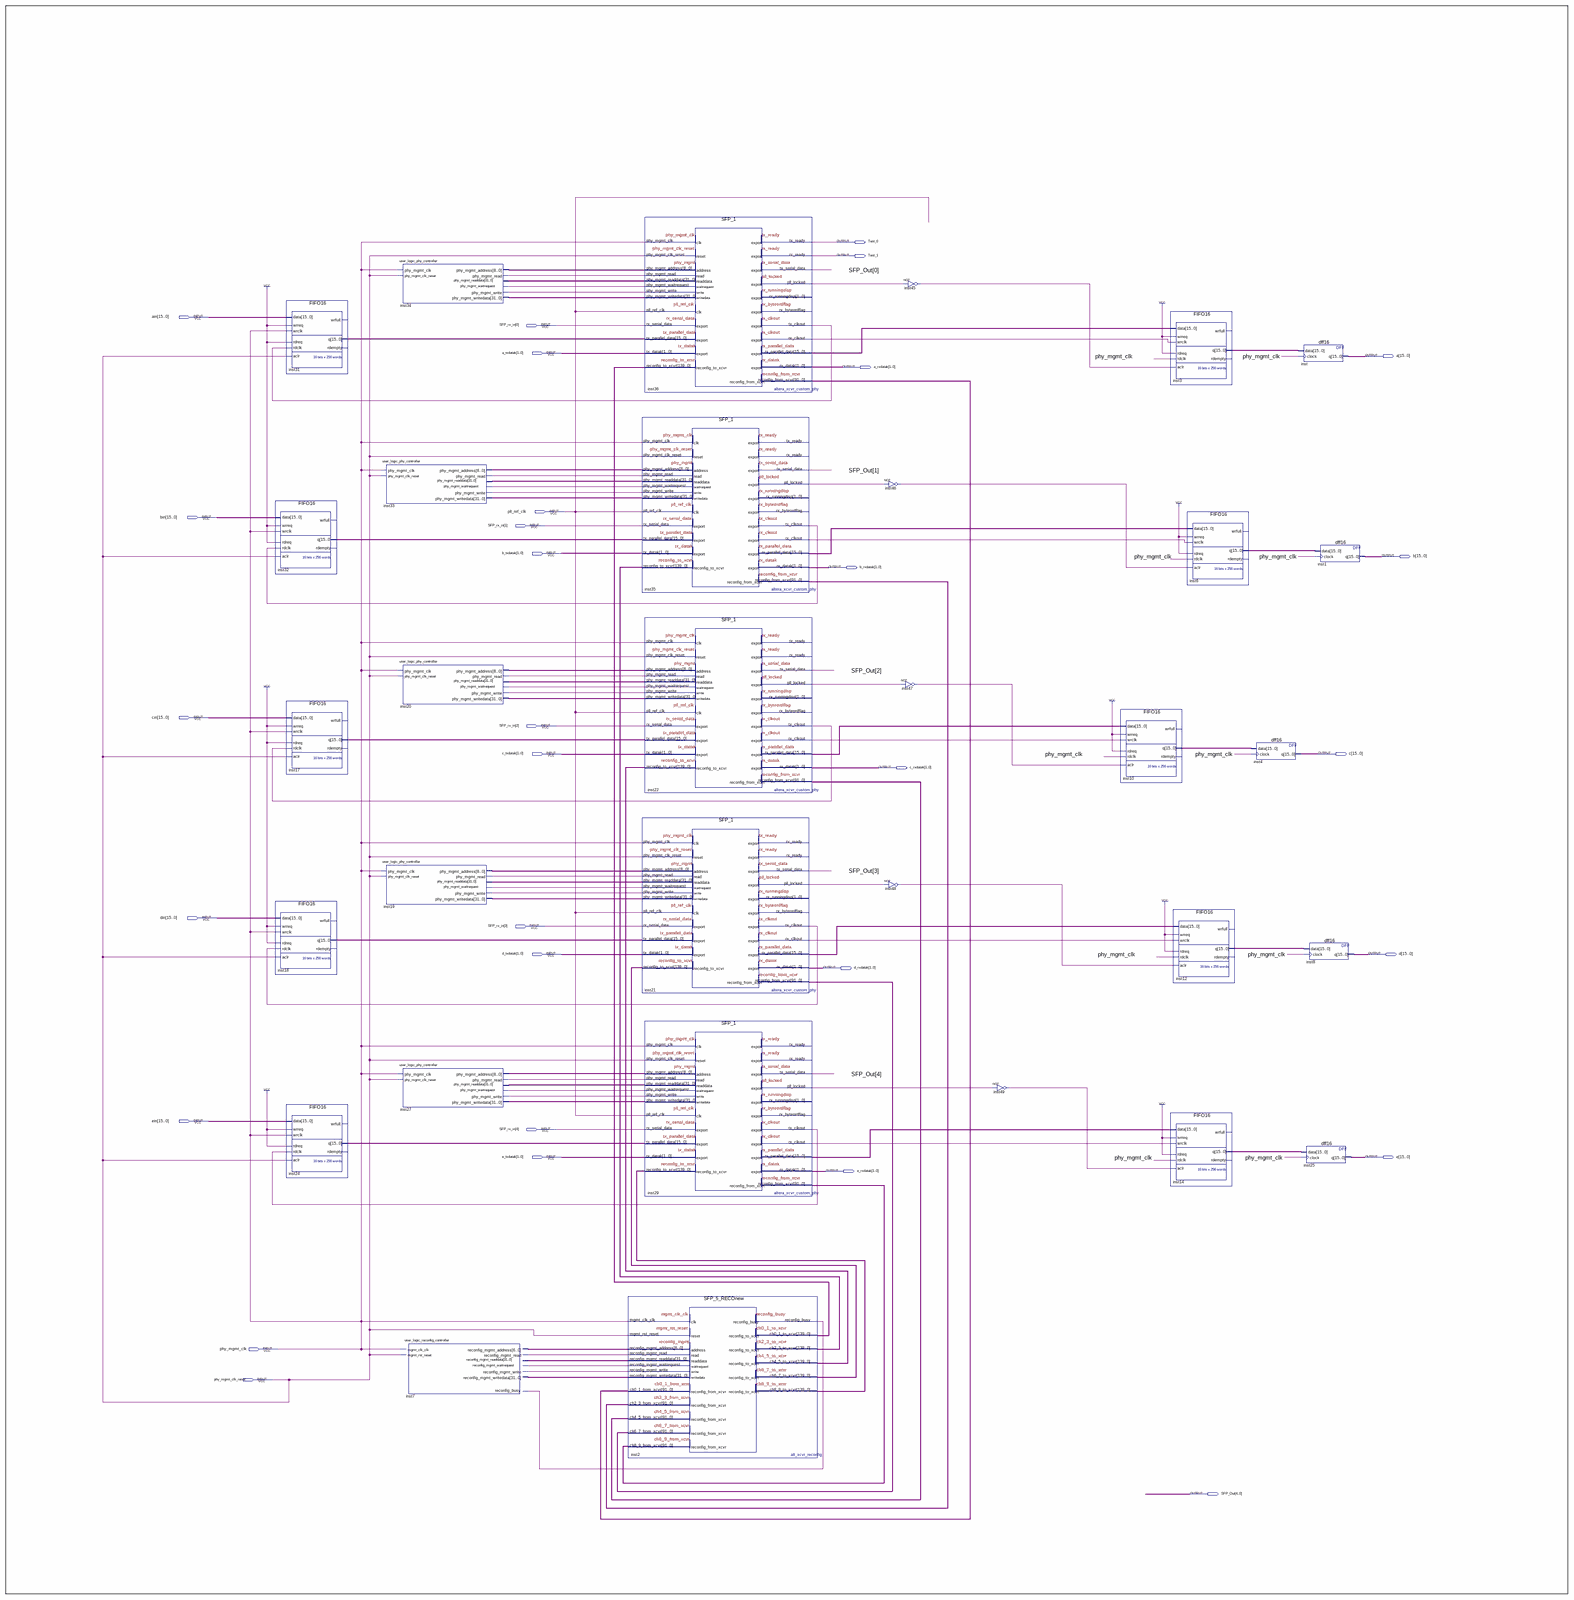
[diagram p0: schematic sheet, whole]
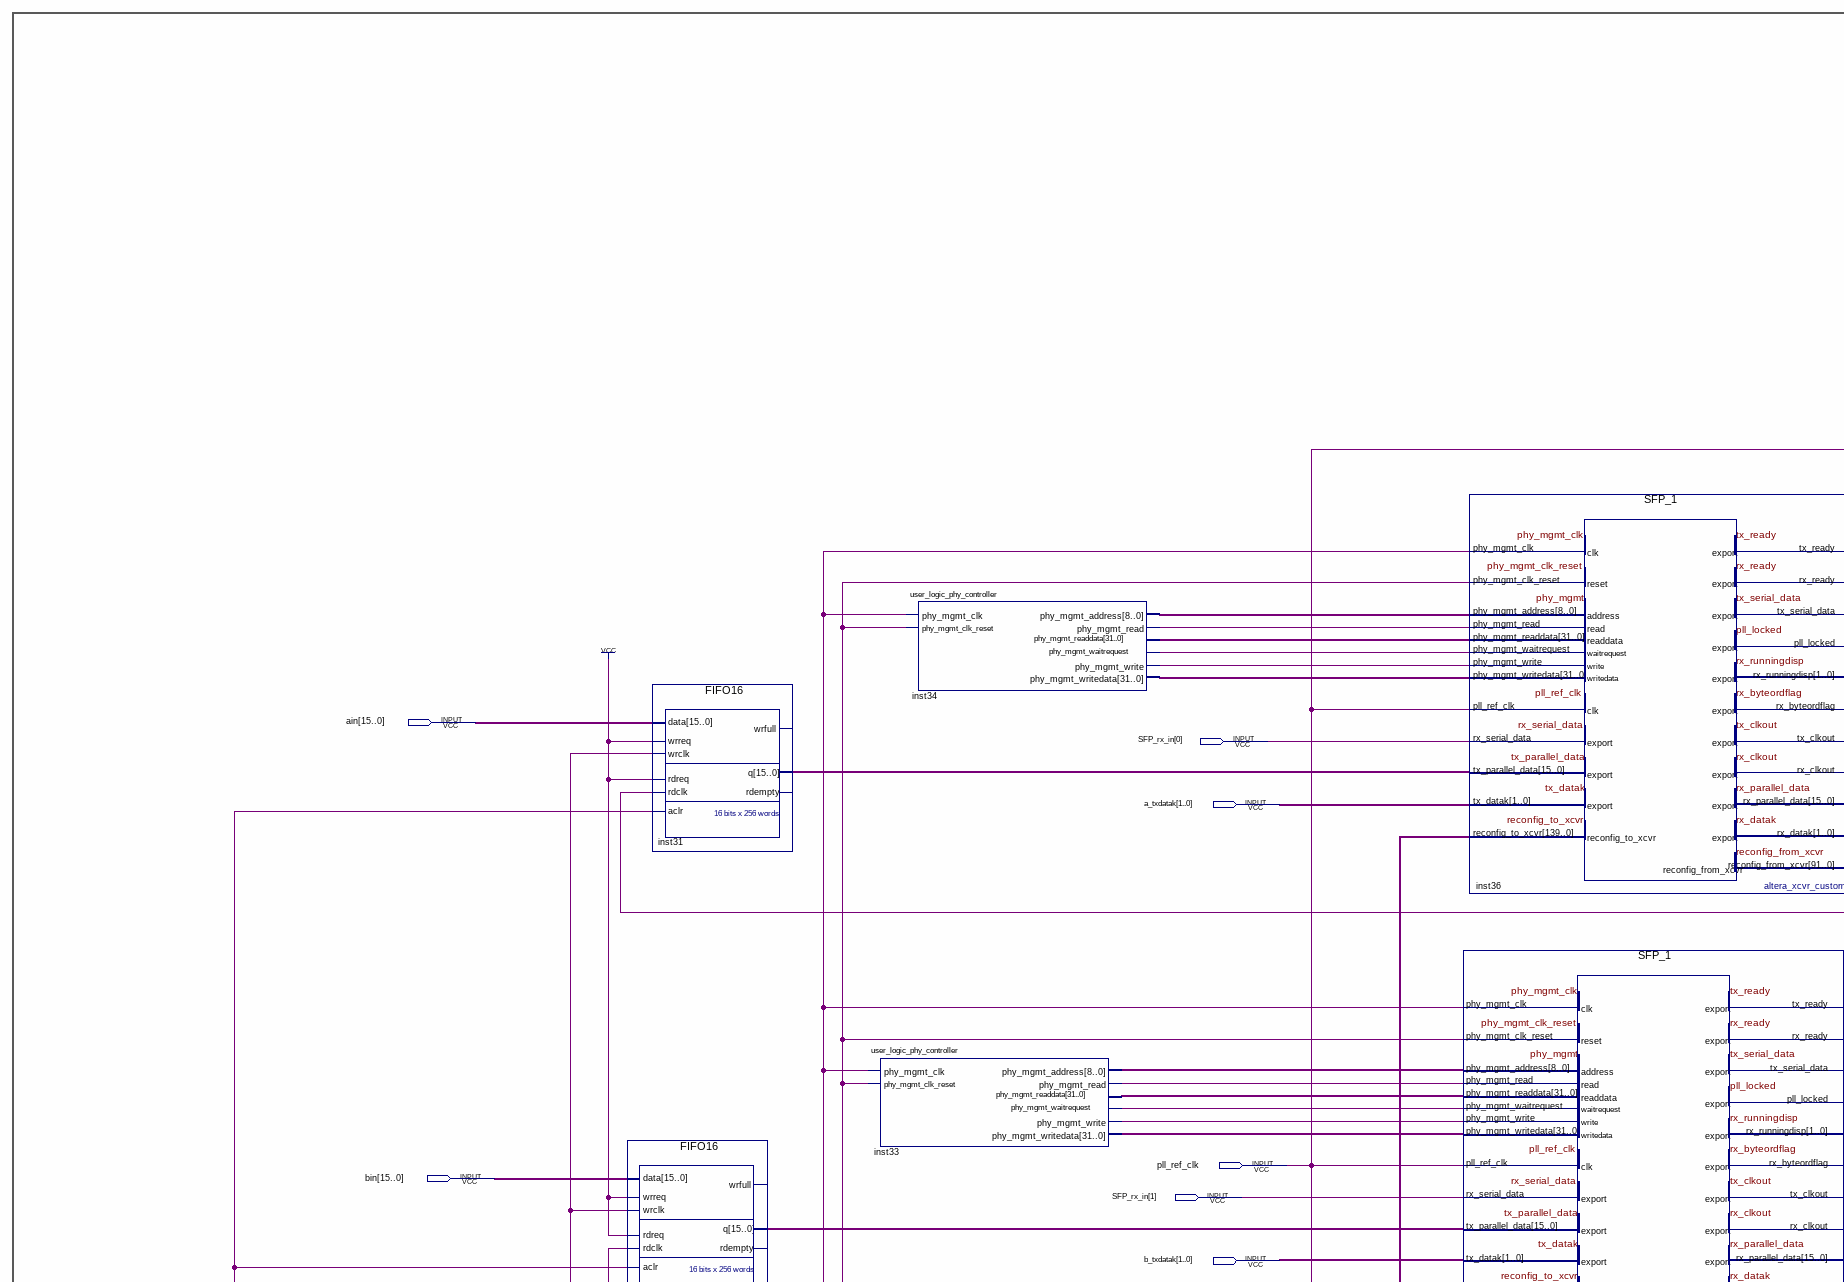
[diagram p1: schematic sheet, upper left part]
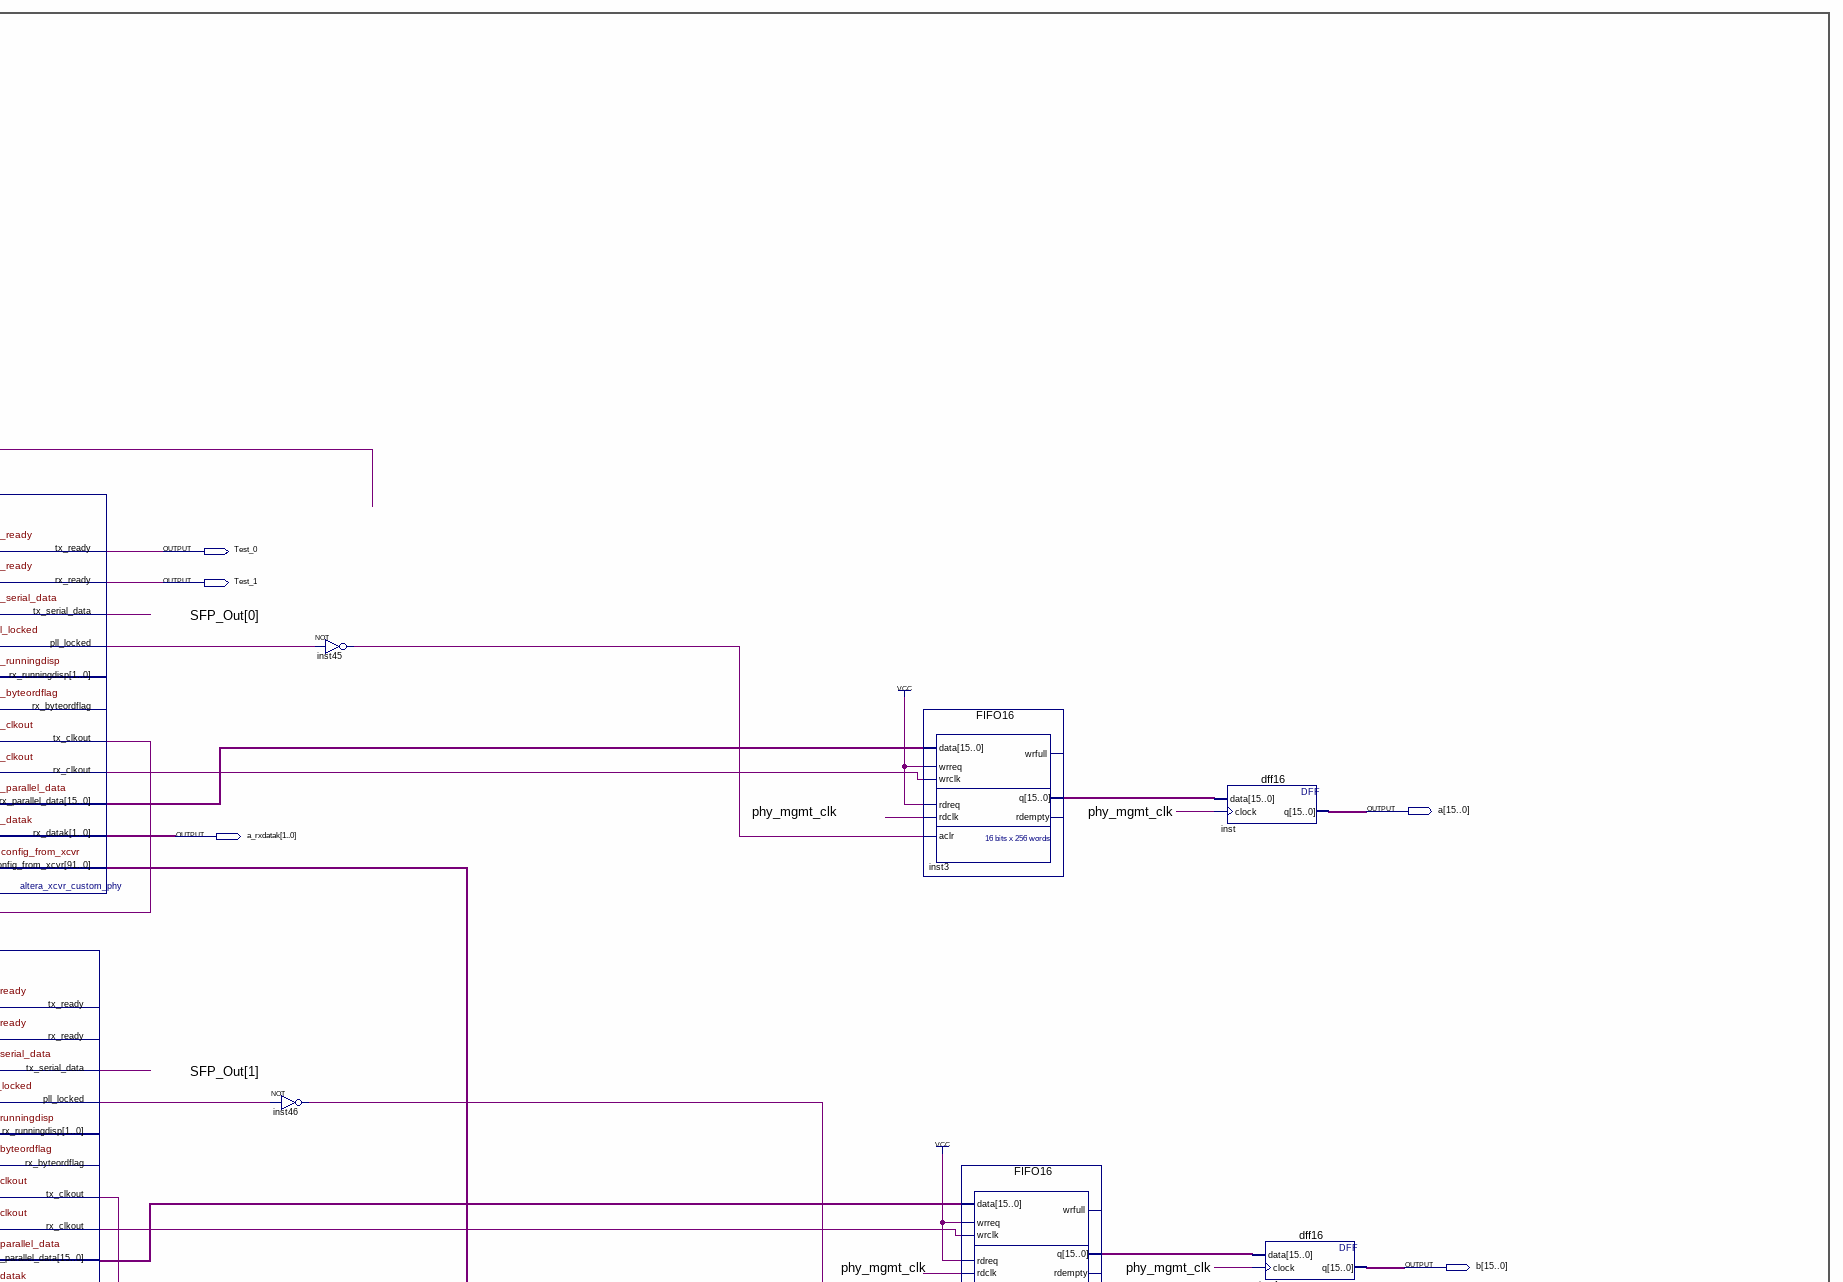
[diagram p2: schematic sheet, upper right part]
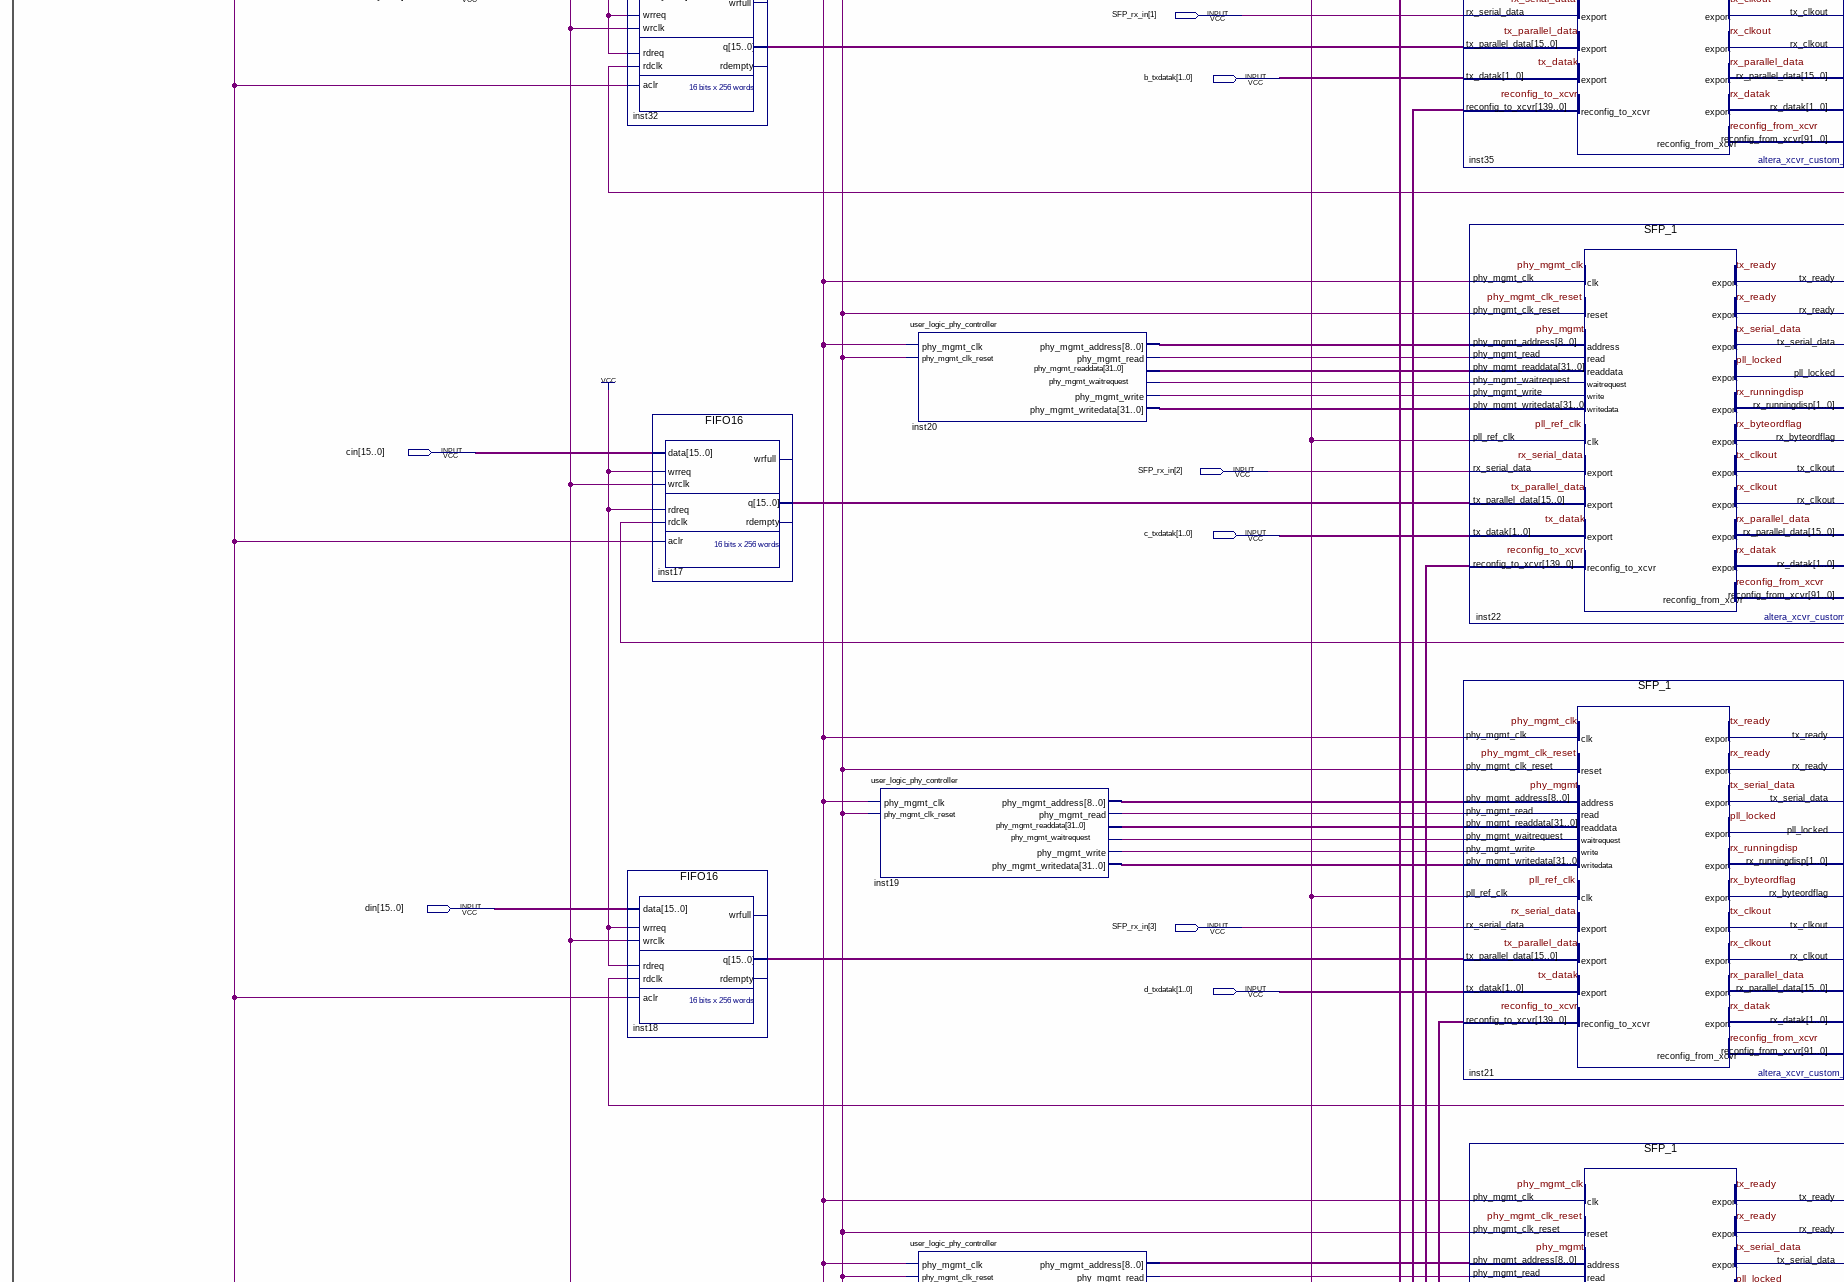
[diagram p3: schematic sheet, middle left part]
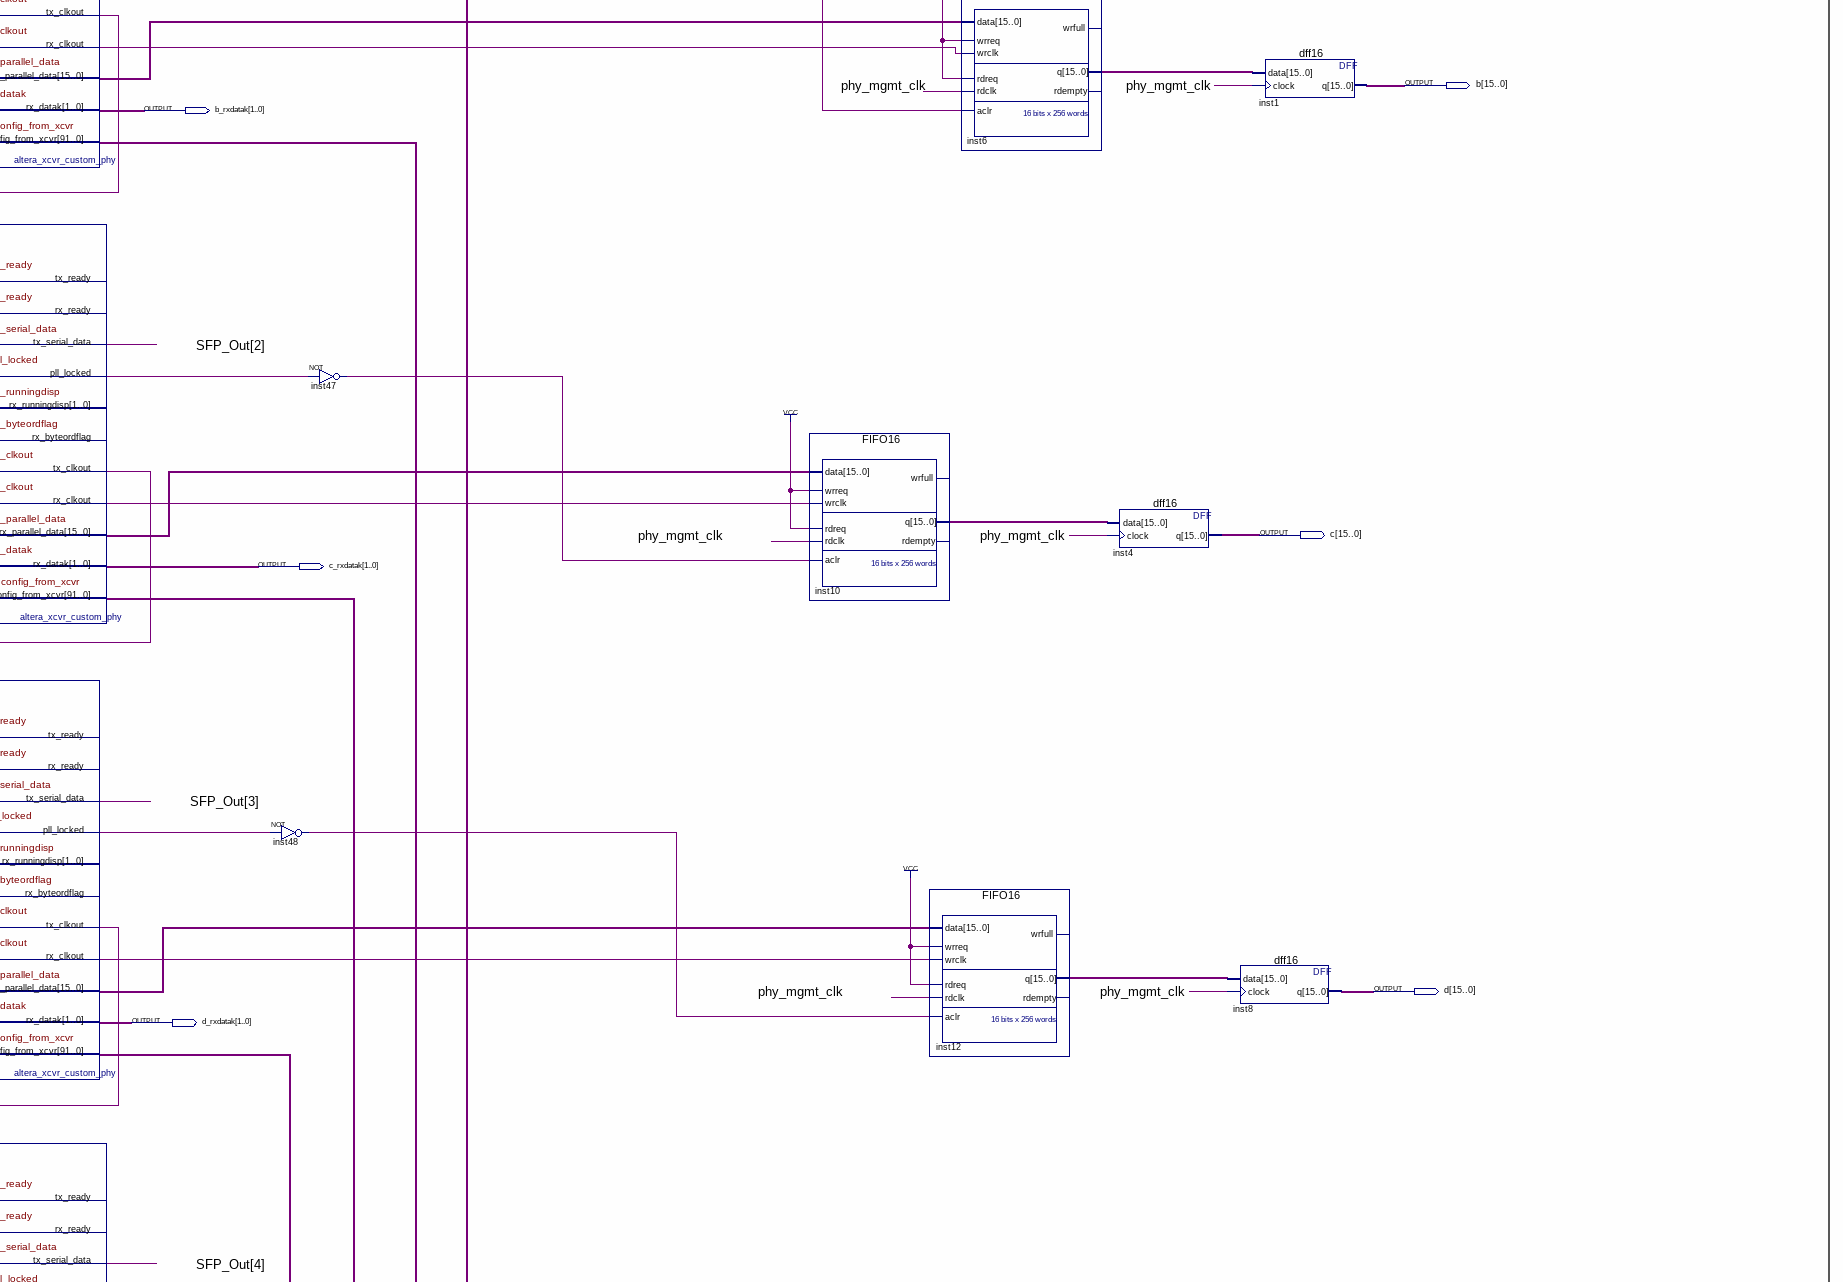
[diagram p4: schematic sheet, middle right part]
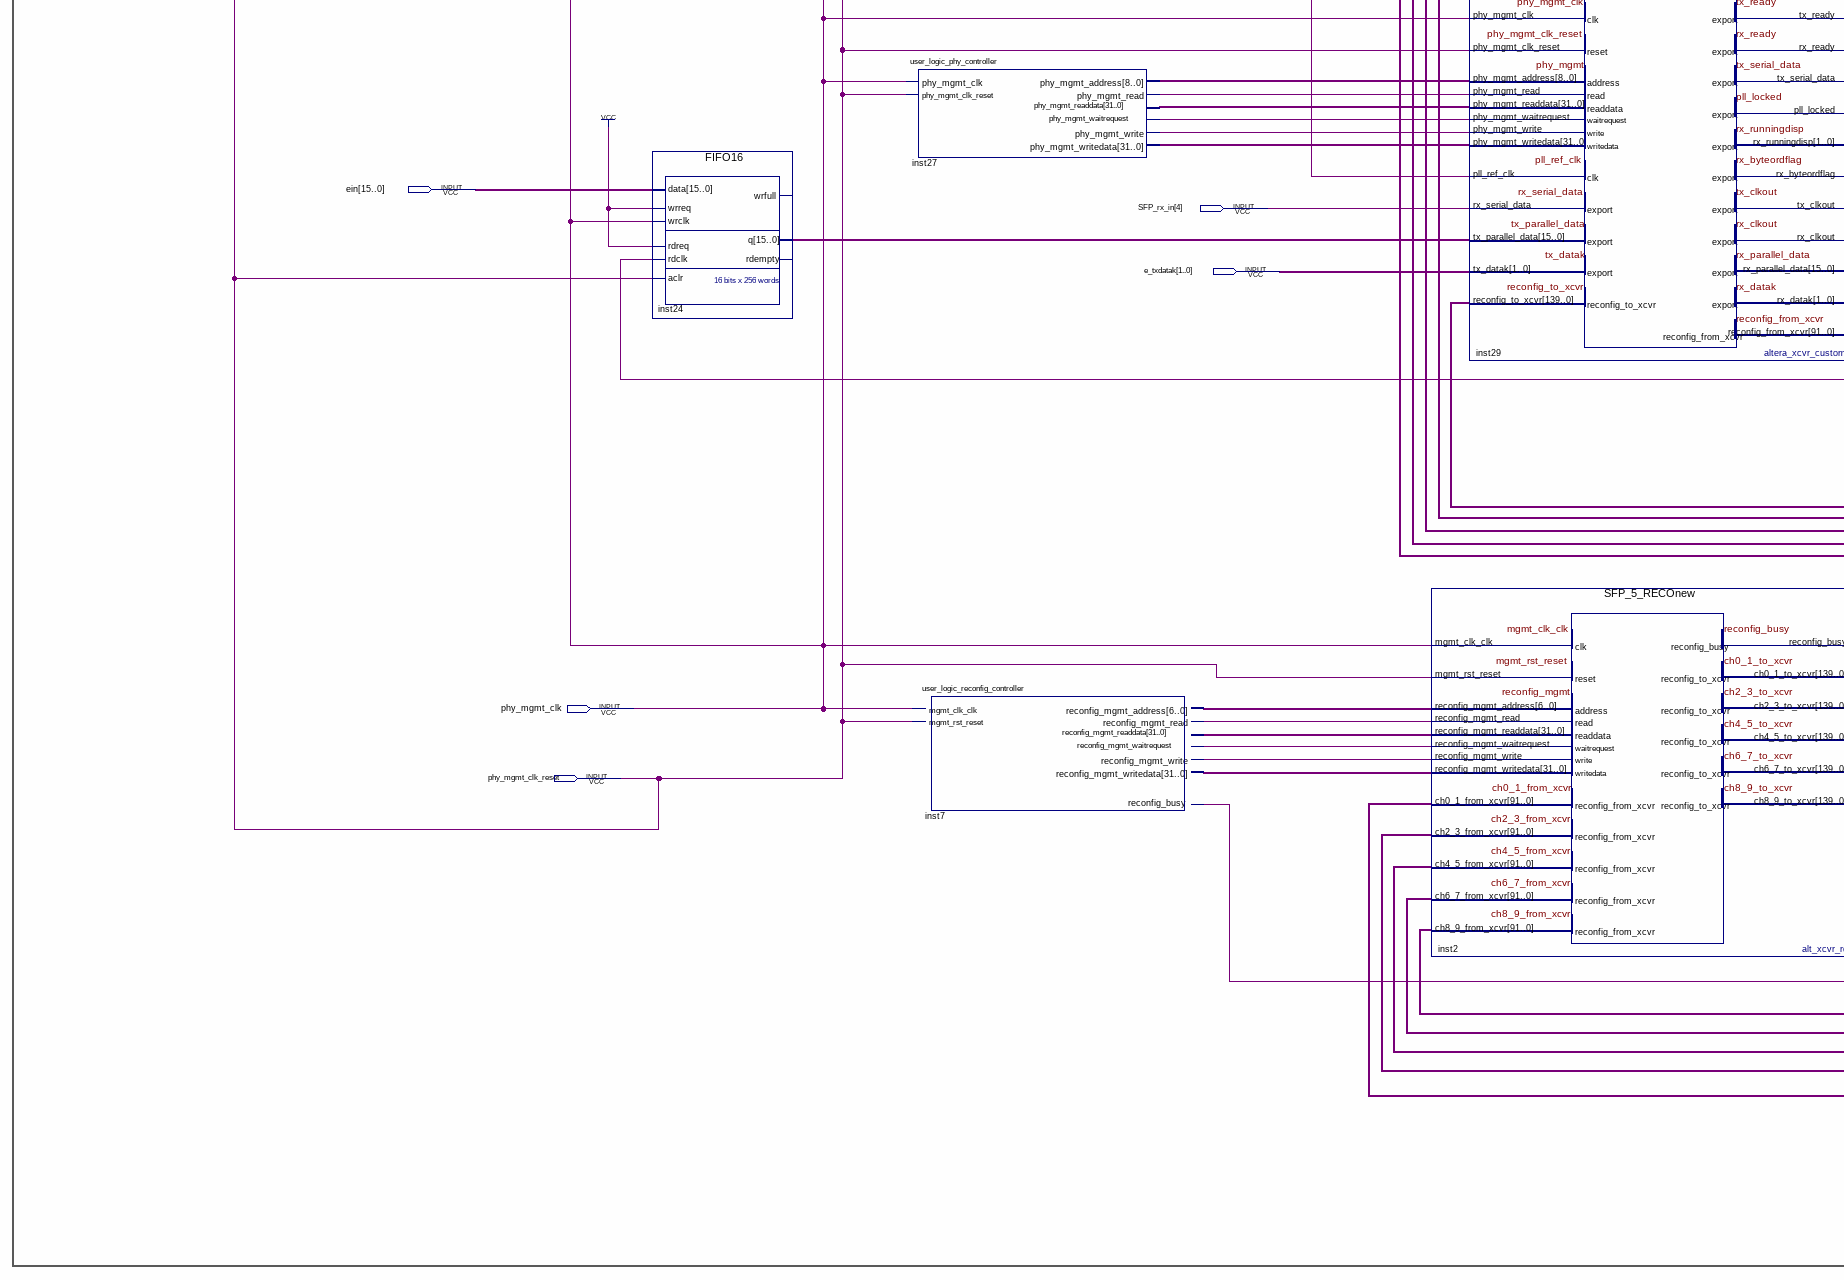
[diagram p5: schematic sheet, lower left part]
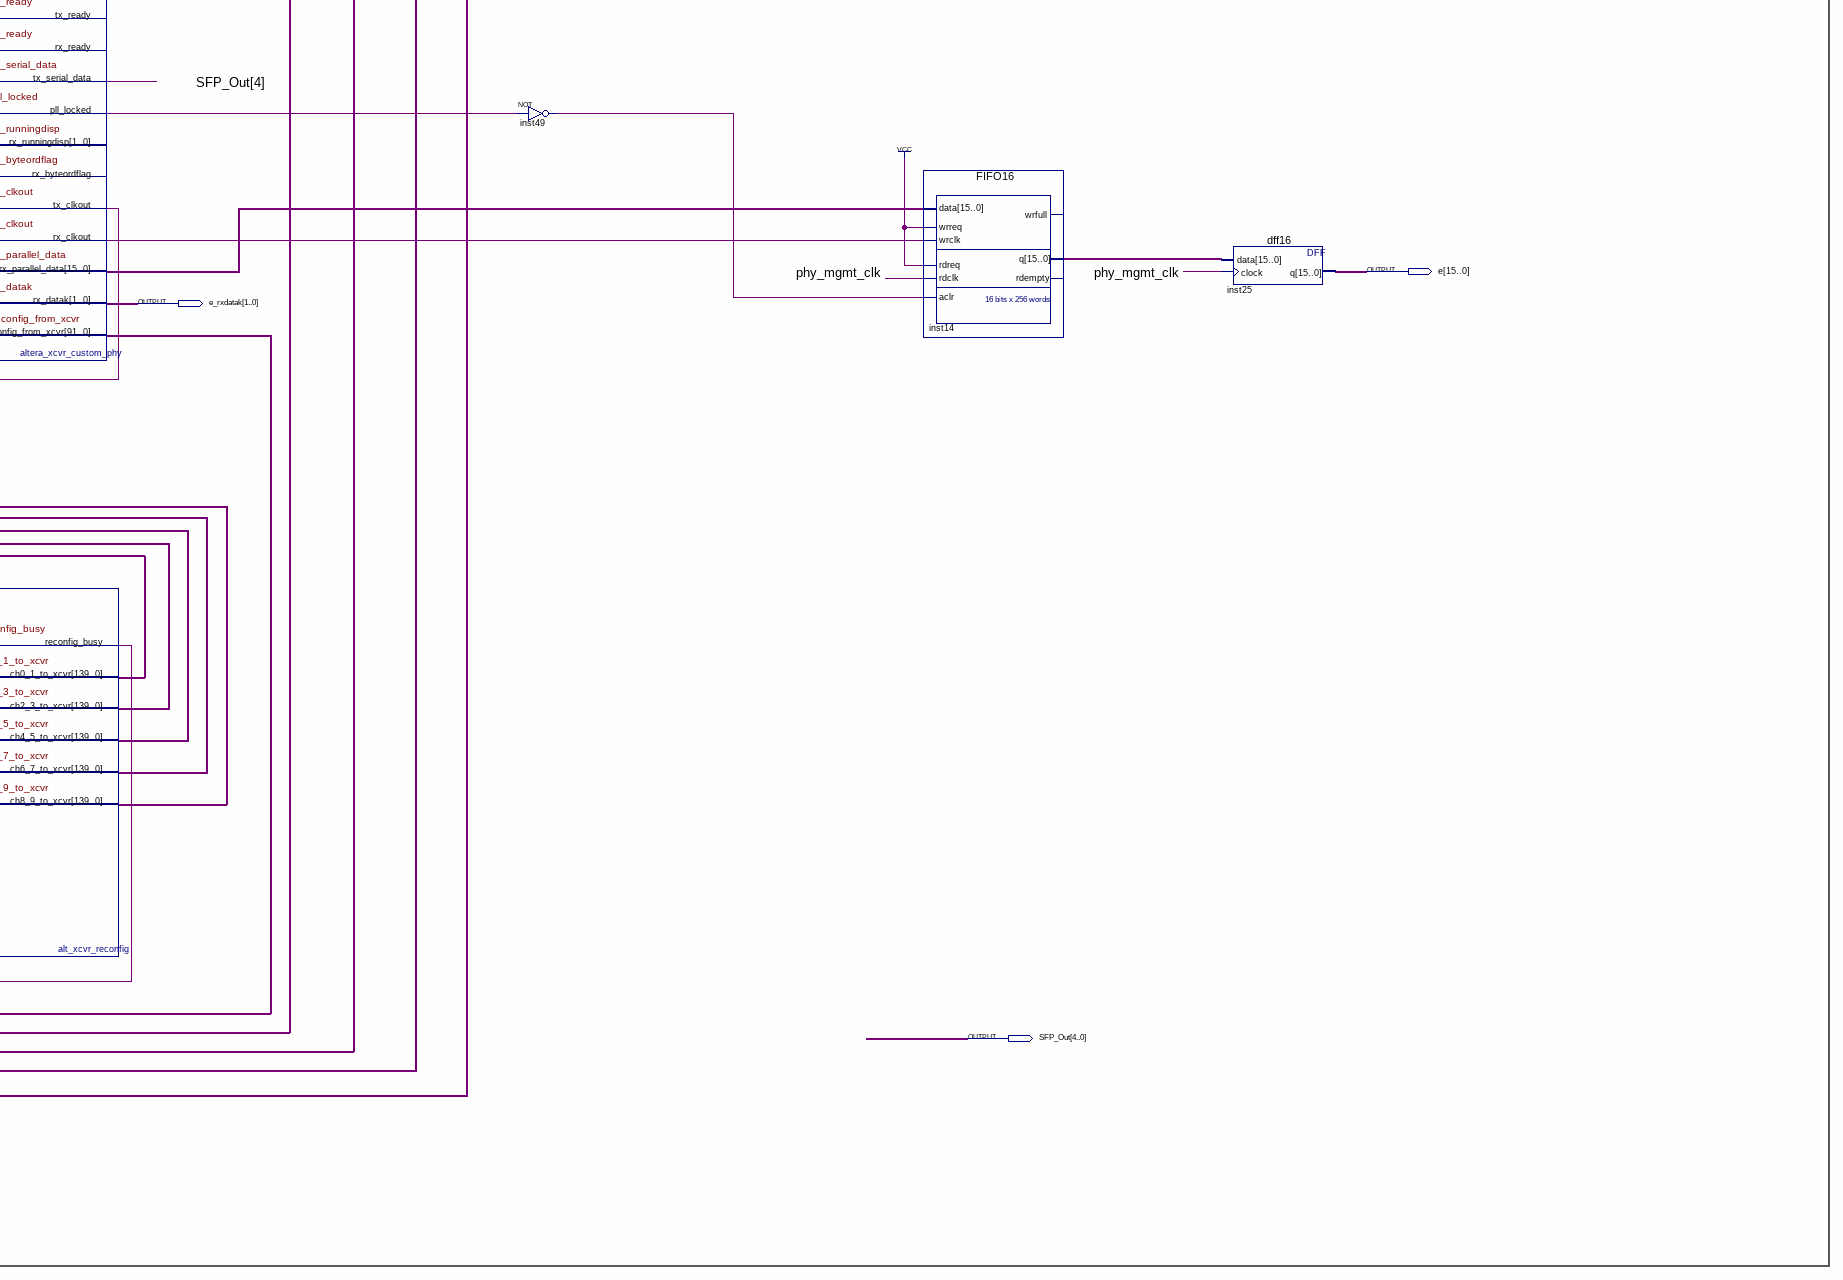
[diagram p6: schematic sheet, lower right part]
// Quartus schematic SFP_GxBlock_x5new.bdf as structural Verilog: 32 symbols, 31 pins
module SFP_GxBlock_x5new (
  input  [15:0] ain,
  input  [4:0] SFP_rx_in,
  input  [1:0] a_txdatak,
  input  pll_ref_clk,
  input  [15:0] bin,
  input  [1:0] b_txdatak,
  input  [15:0] cin,
  input  [1:0] c_txdatak,
  input  [15:0] din,
  input  [1:0] d_txdatak,
  input  [15:0] ein,
  input  [1:0] e_txdatak,
  input  phy_mgmt_clk,
  input  phy_mgmt_clk_reset,
  output Test_0,
  output Test_1,
  output [15:0] a,
  output [1:0] a_rxdatak,
  output [15:0] b,
  output [1:0] b_rxdatak,
  output [15:0] c,
  output [1:0] c_rxdatak,
  output [15:0] d,
  output [1:0] d_rxdatak,
  output [15:0] e,
  output [1:0] e_rxdatak,
  output [4:0] SFP_Out
);

  wire inst2_reconfig_busy, inst2_reconfig_mgmt_waitrequest, inst7_reconfig_mgmt_read,
       inst7_reconfig_mgmt_write, inst19_phy_mgmt_read, inst19_phy_mgmt_write, inst20_phy_mgmt_read,
       inst20_phy_mgmt_write, inst21_phy_mgmt_waitrequest, inst21_pll_locked, inst21_rx_clkout,
       inst21_tx_clkout, inst22_phy_mgmt_waitrequest, inst22_pll_locked, inst22_rx_clkout, inst22_tx_clkout,
       inst27_phy_mgmt_read, inst27_phy_mgmt_write, inst29_phy_mgmt_waitrequest, inst29_pll_locked,
       inst29_rx_clkout, inst29_tx_clkout, inst33_phy_mgmt_read, inst33_phy_mgmt_write, inst34_phy_mgmt_read,
       inst34_phy_mgmt_write, inst35_phy_mgmt_waitrequest, inst35_pll_locked, inst35_rx_clkout,
       inst35_tx_clkout, inst36_phy_mgmt_waitrequest, inst36_pll_locked, inst36_rx_clkout, inst36_tx_clkout,
       inst45_out, inst46_out, inst47_out, inst48_out, inst49_out;
  wire [6:0] inst7_reconfig_mgmt_address;
  wire [8:0] inst19_phy_mgmt_address, inst20_phy_mgmt_address, inst27_phy_mgmt_address,
       inst33_phy_mgmt_address, inst34_phy_mgmt_address;
  wire [15:0] inst3_q, inst6_q, inst10_q, inst12_q, inst14_q, inst17_q, inst18_q, inst21_rx_parallel_data,
       inst22_rx_parallel_data, inst24_q, inst29_rx_parallel_data, inst31_q, inst32_q,
       inst35_rx_parallel_data, inst36_rx_parallel_data;
  wire [31:0] inst2_reconfig_mgmt_readdata, inst7_reconfig_mgmt_writedata, inst19_phy_mgmt_writedata,
       inst20_phy_mgmt_writedata, inst21_phy_mgmt_readdata, inst22_phy_mgmt_readdata,
       inst27_phy_mgmt_writedata, inst29_phy_mgmt_readdata, inst33_phy_mgmt_writedata,
       inst34_phy_mgmt_writedata, inst35_phy_mgmt_readdata, inst36_phy_mgmt_readdata;
  wire [91:0] inst21_reconfig_from_xcvr, inst22_reconfig_from_xcvr, inst29_reconfig_from_xcvr,
       inst35_reconfig_from_xcvr, inst36_reconfig_from_xcvr;
  wire [139:0] inst2_ch0_1_to_xcvr, inst2_ch2_3_to_xcvr, inst2_ch4_5_to_xcvr, inst2_ch6_7_to_xcvr,
       inst2_ch8_9_to_xcvr;

  FIFO16 inst32 (
    .data(bin), .wrreq(1'b1), .wrclk(phy_mgmt_clk), .rdreq(1'b1), .rdclk(inst35_tx_clkout),
    .aclr(phy_mgmt_clk_reset), .q(inst32_q));  // open: wrfull, rdempty
  FIFO16 inst18 (
    .data(din), .wrreq(1'b1), .wrclk(phy_mgmt_clk), .rdreq(1'b1), .rdclk(inst21_tx_clkout),
    .aclr(phy_mgmt_clk_reset), .q(inst18_q));  // open: wrfull, rdempty
  FIFO16 inst31 (
    .data(ain), .wrreq(1'b1), .wrclk(phy_mgmt_clk), .rdreq(1'b1), .rdclk(inst36_tx_clkout),
    .aclr(phy_mgmt_clk_reset), .q(inst31_q));  // open: wrfull, rdempty
  FIFO16 inst17 (
    .data(cin), .wrreq(1'b1), .wrclk(phy_mgmt_clk), .rdreq(1'b1), .rdclk(inst22_tx_clkout),
    .aclr(phy_mgmt_clk_reset), .q(inst17_q));  // open: wrfull, rdempty
  FIFO16 inst24 (
    .data(ein), .wrreq(1'b1), .wrclk(phy_mgmt_clk), .rdreq(1'b1), .rdclk(inst29_tx_clkout),
    .aclr(phy_mgmt_clk_reset), .q(inst24_q));  // open: wrfull, rdempty
  user_logic_phy_controller inst33 (
    .phy_mgmt_clk(phy_mgmt_clk), .phy_mgmt_clk_reset(phy_mgmt_clk_reset),
    .phy_mgmt_readdata(inst35_phy_mgmt_readdata), .phy_mgmt_waitrequest(inst35_phy_mgmt_waitrequest),
    .phy_mgmt_address(inst33_phy_mgmt_address), .phy_mgmt_read(inst33_phy_mgmt_read),
    .phy_mgmt_write(inst33_phy_mgmt_write), .phy_mgmt_writedata(inst33_phy_mgmt_writedata));
  user_logic_phy_controller inst19 (
    .phy_mgmt_clk(phy_mgmt_clk), .phy_mgmt_clk_reset(phy_mgmt_clk_reset),
    .phy_mgmt_readdata(inst21_phy_mgmt_readdata), .phy_mgmt_waitrequest(inst21_phy_mgmt_waitrequest),
    .phy_mgmt_address(inst19_phy_mgmt_address), .phy_mgmt_read(inst19_phy_mgmt_read),
    .phy_mgmt_write(inst19_phy_mgmt_write), .phy_mgmt_writedata(inst19_phy_mgmt_writedata));
  user_logic_phy_controller inst34 (
    .phy_mgmt_clk(phy_mgmt_clk), .phy_mgmt_clk_reset(phy_mgmt_clk_reset),
    .phy_mgmt_readdata(inst36_phy_mgmt_readdata), .phy_mgmt_waitrequest(inst36_phy_mgmt_waitrequest),
    .phy_mgmt_address(inst34_phy_mgmt_address), .phy_mgmt_read(inst34_phy_mgmt_read),
    .phy_mgmt_write(inst34_phy_mgmt_write), .phy_mgmt_writedata(inst34_phy_mgmt_writedata));
  user_logic_phy_controller inst20 (
    .phy_mgmt_clk(phy_mgmt_clk), .phy_mgmt_clk_reset(phy_mgmt_clk_reset),
    .phy_mgmt_readdata(inst22_phy_mgmt_readdata), .phy_mgmt_waitrequest(inst22_phy_mgmt_waitrequest),
    .phy_mgmt_address(inst20_phy_mgmt_address), .phy_mgmt_read(inst20_phy_mgmt_read),
    .phy_mgmt_write(inst20_phy_mgmt_write), .phy_mgmt_writedata(inst20_phy_mgmt_writedata));
  user_logic_phy_controller inst27 (
    .phy_mgmt_clk(phy_mgmt_clk), .phy_mgmt_clk_reset(phy_mgmt_clk_reset),
    .phy_mgmt_readdata(inst29_phy_mgmt_readdata), .phy_mgmt_waitrequest(inst29_phy_mgmt_waitrequest),
    .phy_mgmt_address(inst27_phy_mgmt_address), .phy_mgmt_read(inst27_phy_mgmt_read),
    .phy_mgmt_write(inst27_phy_mgmt_write), .phy_mgmt_writedata(inst27_phy_mgmt_writedata));
  user_logic_reconfig_controller inst7 (
    .reconfig_busy(inst2_reconfig_busy), .mgmt_clk_clk(phy_mgmt_clk), .mgmt_rst_reset(phy_mgmt_clk_reset),
    .reconfig_mgmt_readdata(inst2_reconfig_mgmt_readdata),
    .reconfig_mgmt_waitrequest(inst2_reconfig_mgmt_waitrequest),
    .reconfig_mgmt_address(inst7_reconfig_mgmt_address), .reconfig_mgmt_read(inst7_reconfig_mgmt_read),
    .reconfig_mgmt_write(inst7_reconfig_mgmt_write), .reconfig_mgmt_writedata(inst7_reconfig_mgmt_writedata));
  SFP_5_RECOnew inst2 (
    .mgmt_clk_clk(phy_mgmt_clk), .mgmt_rst_reset(phy_mgmt_clk_reset),
    .reconfig_mgmt_address(inst7_reconfig_mgmt_address), .reconfig_mgmt_read(inst7_reconfig_mgmt_read),
    .reconfig_mgmt_write(inst7_reconfig_mgmt_write), .reconfig_mgmt_writedata(inst7_reconfig_mgmt_writedata),
    .ch0_1_from_xcvr(inst36_reconfig_from_xcvr), .ch2_3_from_xcvr(inst35_reconfig_from_xcvr),
    .ch4_5_from_xcvr(inst22_reconfig_from_xcvr), .ch6_7_from_xcvr(inst21_reconfig_from_xcvr),
    .ch8_9_from_xcvr(inst29_reconfig_from_xcvr), .reconfig_busy(inst2_reconfig_busy),
    .reconfig_mgmt_readdata(inst2_reconfig_mgmt_readdata),
    .reconfig_mgmt_waitrequest(inst2_reconfig_mgmt_waitrequest), .ch0_1_to_xcvr(inst2_ch0_1_to_xcvr),
    .ch2_3_to_xcvr(inst2_ch2_3_to_xcvr), .ch4_5_to_xcvr(inst2_ch4_5_to_xcvr),
    .ch6_7_to_xcvr(inst2_ch6_7_to_xcvr), .ch8_9_to_xcvr(inst2_ch8_9_to_xcvr));
  SFP_1 inst36 (
    .phy_mgmt_clk(phy_mgmt_clk), .phy_mgmt_clk_reset(phy_mgmt_clk_reset),
    .phy_mgmt_address(inst34_phy_mgmt_address), .phy_mgmt_read(inst34_phy_mgmt_read),
    .phy_mgmt_write(inst34_phy_mgmt_write), .phy_mgmt_writedata(inst34_phy_mgmt_writedata),
    .pll_ref_clk(pll_ref_clk), .rx_serial_data(SFP_rx_in[0]), .tx_parallel_data(inst31_q),
    .tx_datak(a_txdatak), .reconfig_to_xcvr(inst2_ch0_1_to_xcvr),
    .phy_mgmt_readdata(inst36_phy_mgmt_readdata), .phy_mgmt_waitrequest(inst36_phy_mgmt_waitrequest),
    .tx_ready(Test_0), .rx_ready(Test_1), .tx_serial_data(SFP_Out[0]), .pll_locked(inst36_pll_locked),
    .tx_clkout(inst36_tx_clkout), .rx_clkout(inst36_rx_clkout), .rx_parallel_data(inst36_rx_parallel_data),
    .rx_datak(a_rxdatak), .reconfig_from_xcvr(inst36_reconfig_from_xcvr));  // open: rx_runningdisp, rx_byteordflag
  SFP_1 inst35 (
    .phy_mgmt_clk(phy_mgmt_clk), .phy_mgmt_clk_reset(phy_mgmt_clk_reset),
    .phy_mgmt_address(inst33_phy_mgmt_address), .phy_mgmt_read(inst33_phy_mgmt_read),
    .phy_mgmt_write(inst33_phy_mgmt_write), .phy_mgmt_writedata(inst33_phy_mgmt_writedata),
    .pll_ref_clk(pll_ref_clk), .rx_serial_data(SFP_rx_in[1]), .tx_parallel_data(inst32_q),
    .tx_datak(b_txdatak), .reconfig_to_xcvr(inst2_ch2_3_to_xcvr),
    .phy_mgmt_readdata(inst35_phy_mgmt_readdata), .phy_mgmt_waitrequest(inst35_phy_mgmt_waitrequest),
    .tx_serial_data(SFP_Out[1]), .pll_locked(inst35_pll_locked), .tx_clkout(inst35_tx_clkout),
    .rx_clkout(inst35_rx_clkout), .rx_parallel_data(inst35_rx_parallel_data), .rx_datak(b_rxdatak),
    .reconfig_from_xcvr(inst35_reconfig_from_xcvr));  // open: tx_ready, rx_ready, rx_runningdisp, rx_byteordflag
  SFP_1 inst22 (
    .phy_mgmt_clk(phy_mgmt_clk), .phy_mgmt_clk_reset(phy_mgmt_clk_reset),
    .phy_mgmt_address(inst20_phy_mgmt_address), .phy_mgmt_read(inst20_phy_mgmt_read),
    .phy_mgmt_write(inst20_phy_mgmt_write), .phy_mgmt_writedata(inst20_phy_mgmt_writedata),
    .pll_ref_clk(pll_ref_clk), .rx_serial_data(SFP_rx_in[2]), .tx_parallel_data(inst17_q),
    .tx_datak(c_txdatak), .reconfig_to_xcvr(inst2_ch4_5_to_xcvr),
    .phy_mgmt_readdata(inst22_phy_mgmt_readdata), .phy_mgmt_waitrequest(inst22_phy_mgmt_waitrequest),
    .tx_serial_data(SFP_Out[2]), .pll_locked(inst22_pll_locked), .tx_clkout(inst22_tx_clkout),
    .rx_clkout(inst22_rx_clkout), .rx_parallel_data(inst22_rx_parallel_data), .rx_datak(c_rxdatak),
    .reconfig_from_xcvr(inst22_reconfig_from_xcvr));  // open: tx_ready, rx_ready, rx_runningdisp, rx_byteordflag
  SFP_1 inst21 (
    .phy_mgmt_clk(phy_mgmt_clk), .phy_mgmt_clk_reset(phy_mgmt_clk_reset),
    .phy_mgmt_address(inst19_phy_mgmt_address), .phy_mgmt_read(inst19_phy_mgmt_read),
    .phy_mgmt_write(inst19_phy_mgmt_write), .phy_mgmt_writedata(inst19_phy_mgmt_writedata),
    .pll_ref_clk(pll_ref_clk), .rx_serial_data(SFP_rx_in[3]), .tx_parallel_data(inst18_q),
    .tx_datak(d_txdatak), .reconfig_to_xcvr(inst2_ch6_7_to_xcvr),
    .phy_mgmt_readdata(inst21_phy_mgmt_readdata), .phy_mgmt_waitrequest(inst21_phy_mgmt_waitrequest),
    .tx_serial_data(SFP_Out[3]), .pll_locked(inst21_pll_locked), .tx_clkout(inst21_tx_clkout),
    .rx_clkout(inst21_rx_clkout), .rx_parallel_data(inst21_rx_parallel_data), .rx_datak(d_rxdatak),
    .reconfig_from_xcvr(inst21_reconfig_from_xcvr));  // open: tx_ready, rx_ready, rx_runningdisp, rx_byteordflag
  SFP_1 inst29 (
    .phy_mgmt_clk(phy_mgmt_clk), .phy_mgmt_clk_reset(phy_mgmt_clk_reset),
    .phy_mgmt_address(inst27_phy_mgmt_address), .phy_mgmt_read(inst27_phy_mgmt_read),
    .phy_mgmt_write(inst27_phy_mgmt_write), .phy_mgmt_writedata(inst27_phy_mgmt_writedata),
    .pll_ref_clk(pll_ref_clk), .rx_serial_data(SFP_rx_in[4]), .tx_parallel_data(inst24_q),
    .tx_datak(e_txdatak), .reconfig_to_xcvr(inst2_ch8_9_to_xcvr),
    .phy_mgmt_readdata(inst29_phy_mgmt_readdata), .phy_mgmt_waitrequest(inst29_phy_mgmt_waitrequest),
    .tx_serial_data(SFP_Out[4]), .pll_locked(inst29_pll_locked), .tx_clkout(inst29_tx_clkout),
    .rx_clkout(inst29_rx_clkout), .rx_parallel_data(inst29_rx_parallel_data), .rx_datak(e_rxdatak),
    .reconfig_from_xcvr(inst29_reconfig_from_xcvr));  // open: tx_ready, rx_ready, rx_runningdisp, rx_byteordflag
  not inst46 (inst46_out, inst35_pll_locked);
  not inst48 (inst48_out, inst21_pll_locked);
  not inst45 (inst45_out, inst36_pll_locked);
  not inst47 (inst47_out, inst22_pll_locked);
  not inst49 (inst49_out, inst29_pll_locked);
  FIFO16 inst10 (
    .data(inst22_rx_parallel_data), .wrreq(1'b1), .wrclk(inst22_rx_clkout), .rdreq(1'b1),
    .rdclk(phy_mgmt_clk), .aclr(inst47_out), .q(inst10_q));  // open: wrfull, rdempty
  FIFO16 inst3 (
    .data(inst36_rx_parallel_data), .wrreq(1'b1), .wrclk(inst36_rx_clkout), .rdreq(1'b1),
    .rdclk(phy_mgmt_clk), .aclr(inst45_out), .q(inst3_q));  // open: wrfull, rdempty
  FIFO16 inst12 (
    .data(inst21_rx_parallel_data), .wrreq(1'b1), .wrclk(inst21_rx_clkout), .rdreq(1'b1),
    .rdclk(phy_mgmt_clk), .aclr(inst48_out), .q(inst12_q));  // open: wrfull, rdempty
  FIFO16 inst14 (
    .data(inst29_rx_parallel_data), .wrreq(1'b1), .wrclk(inst29_rx_clkout), .rdreq(1'b1),
    .rdclk(phy_mgmt_clk), .aclr(inst49_out), .q(inst14_q));  // open: wrfull, rdempty
  FIFO16 inst6 (
    .data(inst35_rx_parallel_data), .wrreq(1'b1), .wrclk(inst35_rx_clkout), .rdreq(1'b1),
    .rdclk(phy_mgmt_clk), .aclr(inst46_out), .q(inst6_q));  // open: wrfull, rdempty
  dff16 inst4 (.data(inst10_q), .clock(phy_mgmt_clk), .q(c));
  dff16 inst (.data(inst3_q), .clock(phy_mgmt_clk), .q(a));
  dff16 inst8 (.data(inst12_q), .clock(phy_mgmt_clk), .q(d));
  dff16 inst25 (.data(inst14_q), .clock(phy_mgmt_clk), .q(e));
  dff16 inst1 (.data(inst6_q), .clock(phy_mgmt_clk), .q(b));
endmodule
